# EAGLE design CurrentMonitorOnAStick (EAGLE 7.4.0)
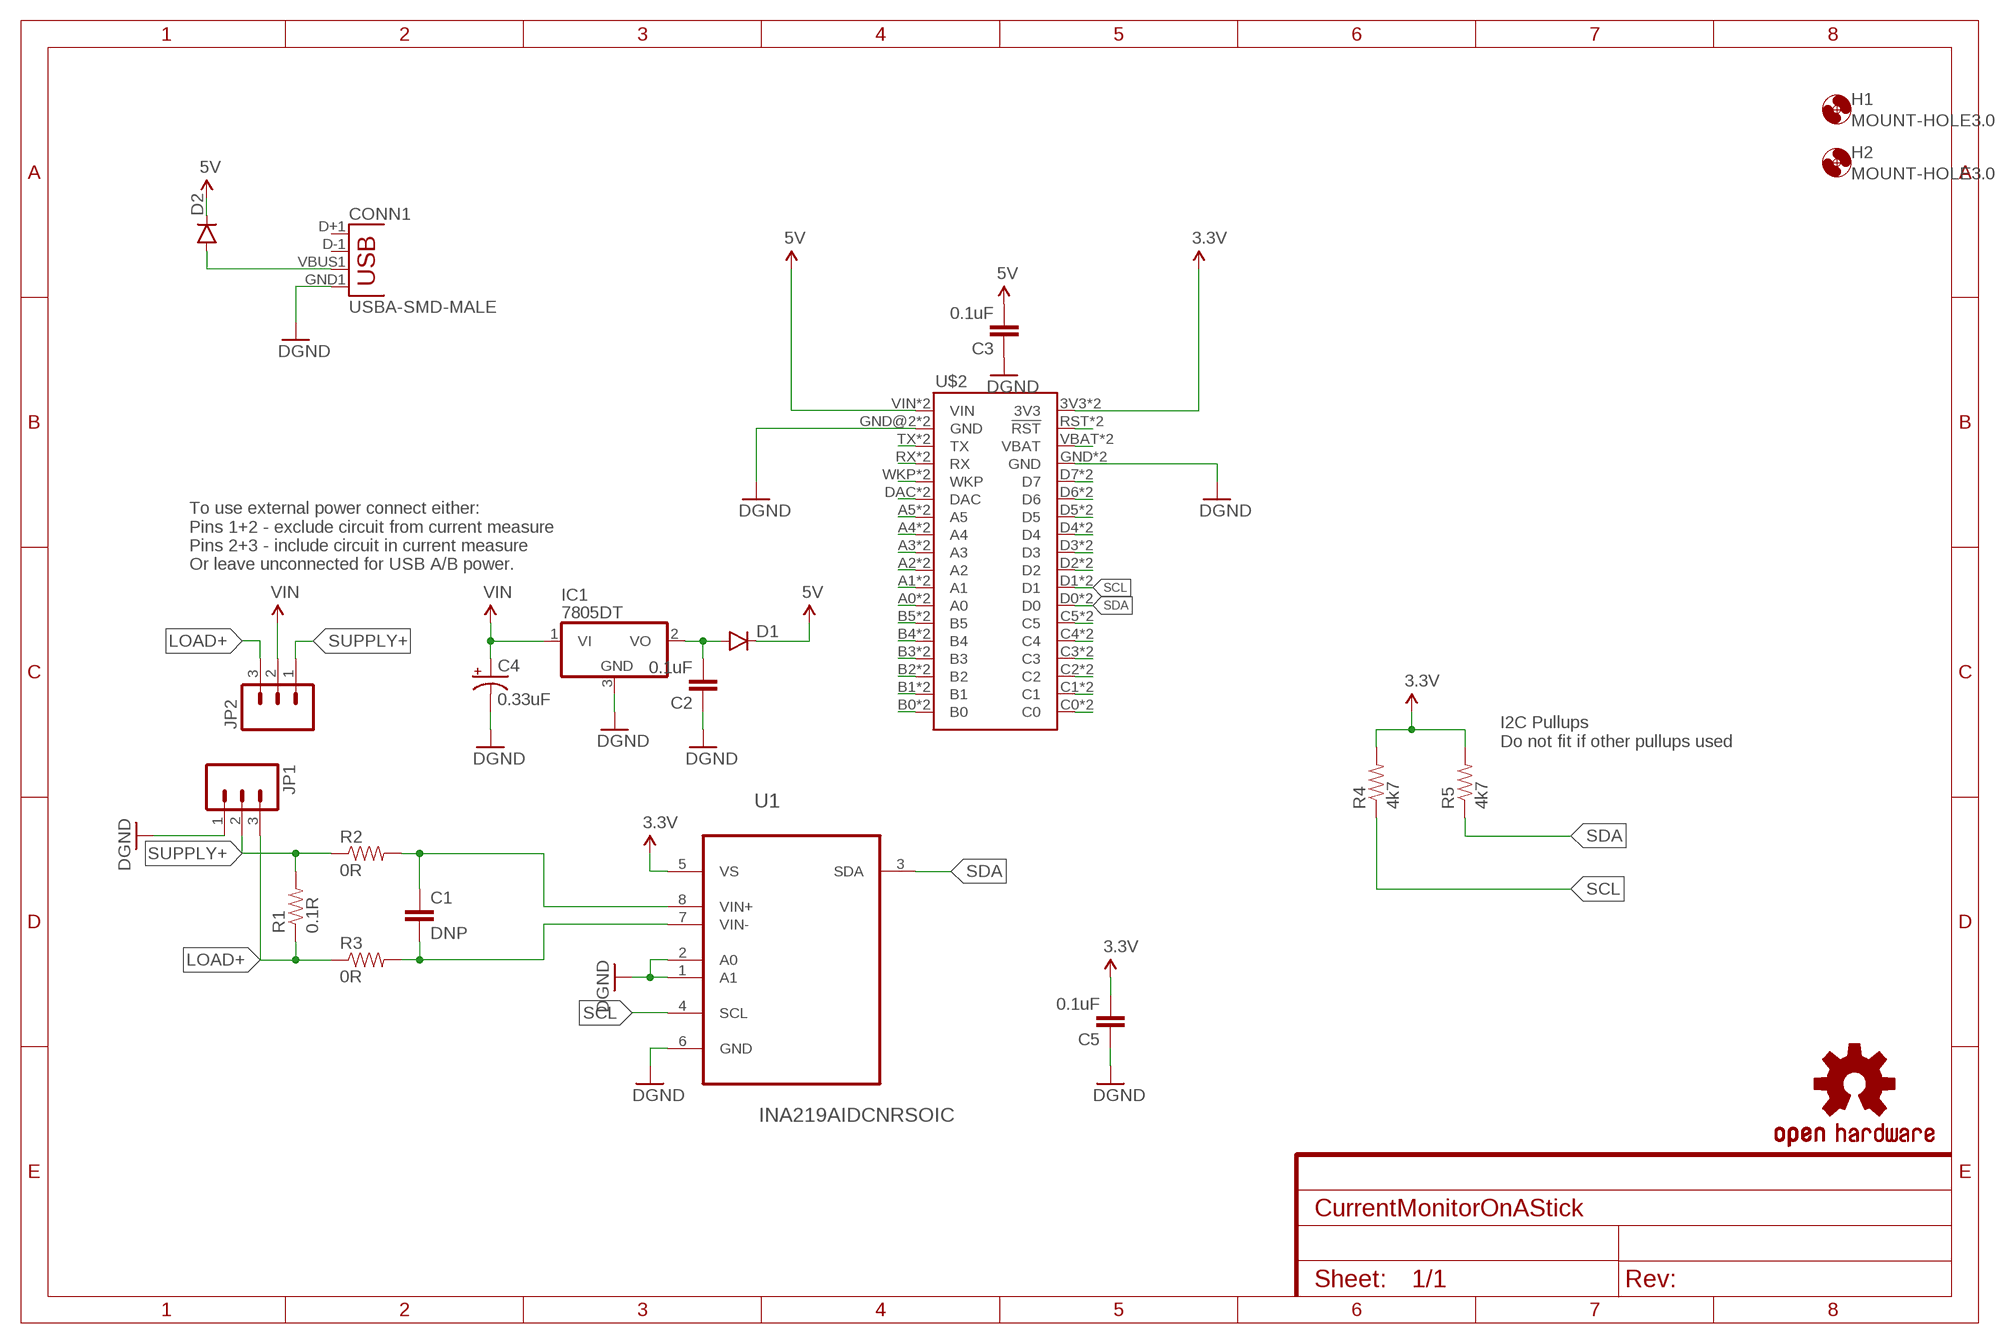
[diagram p0: schematic, sheet 1]

## Parts
C1  DNP  CAP0805  [0805]
C2  0.1uF  CAP0805  [0805]
C3  0.1uF  CAP0805  [0805]
C4  0.33uF  10UF-16V-10%(TANT)  [EIA3216]
C5  0.1uF  CAP0805  [0805]
CONN1  USBA-SMD-MALE  [USB-A-SMT-MALE]
D1  DIODESMA  [SMA-DIODE]
D2  DIODESMA  [SMA-DIODE]
H1  MOUNT-HOLE3.0  [3,0]
H2  MOUNT-HOLE3.0  [3,0]
IC1  7805DT  [TO252]
JP1  M03-SCREW-5MM  [SCREWTERMINAL-5MM-3]
JP2  M03PTH  [1X03]
LOGO2  OSHW-LOGOS  [OSHW-LOGO-S]
R1  0.1R  0.001OHM-3W-1%(2512)3W/1%  [2512]
R2  0R  RESISTOR0805-RES  [0805]
R3  0R  RESISTOR0805-RES  [0805]
R4  4k7  RESISTOR0805-RES  [0805]
R5  4k7  RESISTOR0805-RES  [0805]
U1  INA219AIDCNRSOIC  [SO08]
U$2  ELECTRONDUALNAMED  [ELECTRON_SIMPLE_SILK_NAMES_DUAL]

## Nets
3.3V: C5.2 R4.2 R5.2 U1.5(VS) U$2.3V3 U$2.3V3_1(3V3)
5V: C3.2 D1.C D2.C U$2.VIN U$2.VIN_1B(VIN)
GND: C2.1 C3.1 C4.C(-) C5.1 CONN1.GND1(GND) IC1.3(GND) JP1.1 U1.1(A1) U1.2(A0) U1.6(GND) U$2.GND U$2.GND@2(GND) U$2.GND_1(GND) U$2.GND_1B(GND) ; supply symbol labelled DGND
LOAD+: JP1.3 JP2.3 R1.1 R3.1
N$1: CONN1.VBUS1(VBUS) D2.A
N$3: C2.2 D1.A IC1.2(VO)
N$4: C1.1 R2.2 U1.8(VIN+)
N$6: U$2.VBAT U$2.VBATT_1(VBAT)
N$7: U$2.RST(!RST) U$2.RST_1(!RST)
N$11: U$2.D7 U$2.D7_1(D7)
N$12: C1.2 R3.2 U1.7(VIN-)
N$15: U$2.D6 U$2.D6_1(D6)
N$16: U$2.D5 U$2.D5_1(D5)
N$20: U$2.D4 U$2.D4_1(D4)
N$21: U$2.D3 U$2.D3_1(D3)
N$22: U$2.D2 U$2.D2_1(D2)
N$23: U$2.C5 U$2.C5_1(C5)
N$24: U$2.C4 U$2.C4_1(C4)
N$25: U$2.C3 U$2.C3_1(C3)
N$26: U$2.C2 U$2.C2_1(C2)
N$28: U$2.C1 U$2.C1_1(C1)
N$29: U$2.C0 U$2.C0_1(C0)
N$31: U$2.B0 U$2.B0_1(B0)
N$33: U$2.B1 U$2.B1_1(B1)
N$35: U$2.B2 U$2.B2_1(B2)
N$36: U$2.B3 U$2.B3_1(B3)
N$37: U$2.B4 U$2.B4_1(B4)
N$38: U$2.B5 U$2.B5_1(B5)
N$39: U$2.A0 U$2.A0_1(A0)
N$40: U$2.A1 U$2.A1_1(A1)
N$41: U$2.A2 U$2.A2_1(A2)
N$42: U$2.A3 U$2.A3_1(A3)
N$43: U$2.A4 U$2.A4_1(A4)
N$44: U$2.A5 U$2.A5_1(A5)
N$45: U$2.DAC U$2.DAC_1(DAC)
N$46: U$2.WKP U$2.WKP_1(WKP)
N$47: U$2.RX U$2.RX_1(RX)
N$48: U$2.TX U$2.TX_1(TX)
SCL: R4.1 U1.4(SCL) U$2.D1 U$2.D1_1(D1)
SDA: R5.1 U1.3(SDA) U$2.D0 U$2.D0_1(D0)
SUPPLY+: JP1.2 JP2.1 R1.2 R2.1
VIN: C4.A(+) IC1.1(VI) JP2.2
Unconnected: CONN1.D+1(D+) CONN1.D-1(D-)

## Notes on the sheet
- To use external power connect either:
  Pins 1+2 - exclude circuit from current measure
  Pins 2+3 - include circuit in current measure
  Or leave unconnected for USB A/B power.
- I2C Pullups
  Do not fit if other pullups used

## Library data of the parts
C1 = SparkFun-Capacitors:CAP: Capacitor Standard 0603 ceramic capacitor, and 0.1" leaded capacitor.
C2 C3 C5 = SparkFun-Passives:CAP: Capacitor Standard 0603 ceramic capacitor, and 0.1" leaded capacitor.
C4 = SparkFun-Capacitors:10UF-16V-10%(TANT): CAP-00811 1206/EIA-3216 Tantalum capacitor; PROD_ID: CAP-00811; VALUE: 10uF
CONN1 = SparkFun-Connectors:USB: USB Connectors USB-B-PTH is fully proven SKU : PRT-00139/CONN-08278 USB-miniB is fully proven SKU : PRT-00587 USB-A-PCB is untested. USB-A-H is throughly reviewed, but untested. Spark Fun Electronics SKU : PRT-00437 USB-B-SMT is throughly reviewed, but untested. Needs silkscreen touching up. USB-A-S has not been used/tested USB-MB-H has not been used/tested USB-MICROB has been used. CONN-09505
D1 D2 = SparkFun-DiscreteSemi:DIODE: Diode These are standard reverse protection diodes and small signal diodes. SMA package can handle up to about 1A. SOD-323 can handle about 200mA. What the SOD-323 package when ordering, there are some mfgs out there that are 5-pin packages.
H1 H2 = holes:MOUNT-HOLE: MOUNTING HOLE with drill center marker
IC1 = linear:78*: Positive VOLTAGE REGULATOR Source: http://cache.national.com/ds/LM/LM78L05.pdf http://www.fairchildsemi.com/ds/LM/LM7805.pdf
JP1 = SparkFun-Connectors:M03: Header 3 Standard 3-pin 0.1" header. Use with straight break away headers (SKU : PRT-00116), right angle break away headers (PRT-00553), swiss pins (PRT-00743), machine pins (PRT-00117), and female headers (PRT-00115). Molex polarized connector foot print use with SKU : PRT-08232 with associated crimp pins and housings.; STOREFRONT_ID: PRT-08433
JP2 = SparkFun-Connectors:M03: Header 3 Standard 3-pin 0.1" header. Use with straight break away headers (SKU : PRT-00116), right angle break away headers (PRT-00553), swiss pins (PRT-00743), machine pins (PRT-00117), and female headers (PRT-00115). Molex polarized connector foot print use with SKU : PRT-08232 with associated crimp pins and housings.
LOGO2 = SparkFun-Aesthetics:OSHW-LOGO: Open Source Hardware Logo This logo indicates the piece of hardware it is found on incorporates a OSHW license and/or adheres to the definition of open source hardware found here: http://freedomdefined.org/OSHW
R1 = SparkFun-Resistors:0.001OHM-3W-1%(2512); PROD_ID: RES-12449; VALUE: 0.001
R2-R5 = SparkFun-Resistors:RESISTOR: Resistor Basic schematic elements and footprints for 0603, 1206, and PTH resistors.
U1 = INA219AIDCNR:INA219AIDCNR: CURRENT/POWER MONITOR
U$2 = Tinamous:ELECTRON

## Board
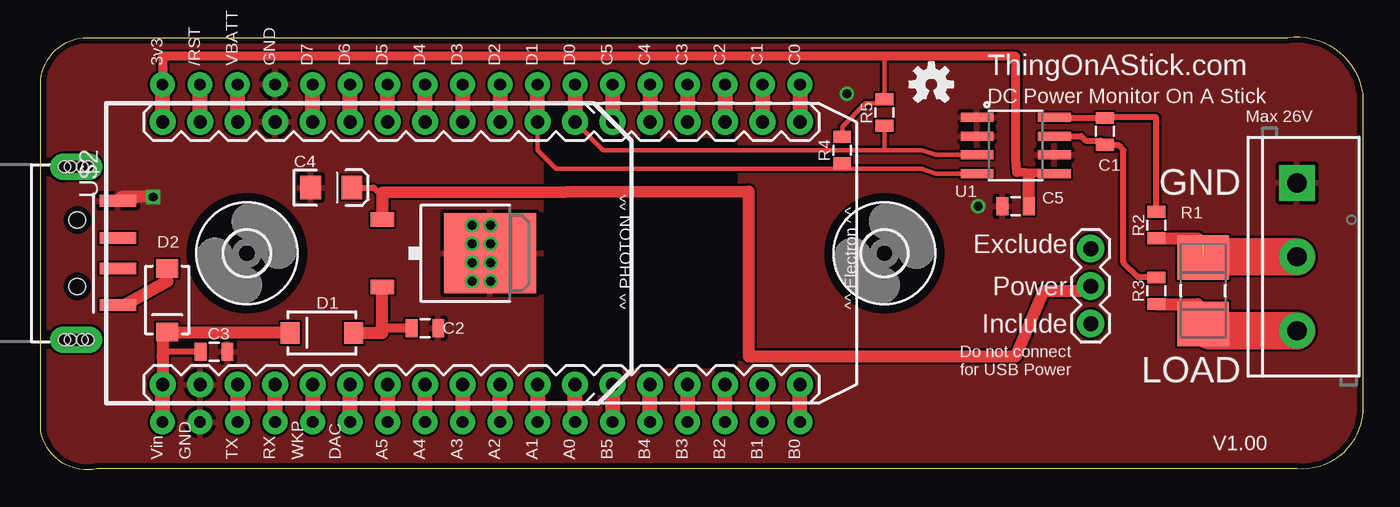
[diagram p1: board, top side]
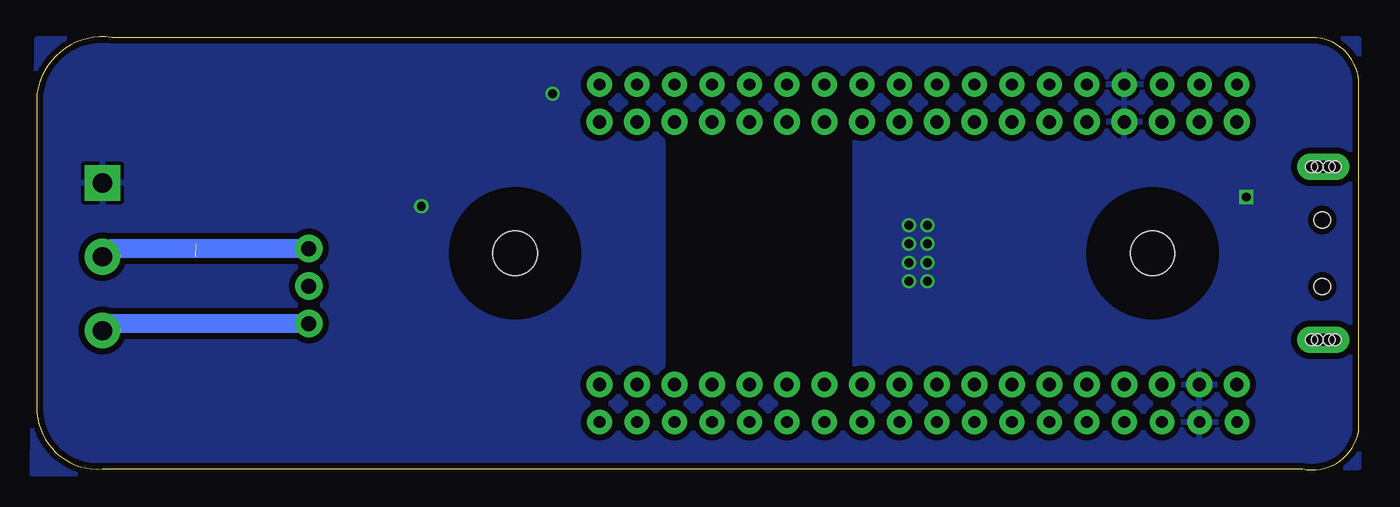
[diagram p2: board, bottom side, seen from below]

Size 89.54 x 29.31 mm. Coordinates in mm from the lower left corner, seen from the top.
Outline: 3.17,29.27 84.45,29.27 arc-90 89.54,25.46 89.54,3.87 arc-90 85.09,0.06 3.81,0.06 arc-90 0,2.6 0,26.1 arc-90 3.17,29.27
Copper layers (1*16): Top 0.0356mm / dielectric 1.5011mm / Bottom 0.0356mm
Design rules "OSHPark": minimum track width 6mil, minimum drill 13mil, track to track 6mil, track to pad 6mil, pad to pad 6mil, via to via 6mil, smd to smd 6mil, copper to edge 15mil, drill to drill 6mil, minimum pad ring 7mil, minimum via ring 7mil, stop-mask expansion 3mil, vias tented up to drill 0mil, thermal gap 10mil
tRestrict: area 34.3,4.5 to 47,24.8
bRestrict: area 34.9,4.5 to 46.4,24.8

### Footprints (pad centres in the part's own frame; a part is rotated, then mirrored left to right if it is on the bottom)
0805 = smd 0.8 x 1.2: 1 -0.9,0; 2 0.9,0
EIA3216 = smd 1.4 x 1.6: A 1.4,0; C -1.4,0
USB-A-SMT-MALE = smd 0.8 x 2.5: D+1 1.027,-5.87; D-1 -1.027,-5.87; GND1 3.551,-5.87; VBUS1 -3.5,-5.87 | drill 0.8 pad 1.778 long: P$1 5.85,-3.05; P$3 -5.85,-3.05 | hole 1.1: 2.25,-3.12; -2.25,-3.12 | hole 0.8: -5.85,-3.45; -5.85,-3.85; -5.85,-2.65; -5.85,-2.25; 5.85,-3.45; 5.85,-3.85; 5.85,-2.65; 5.85,-2.25
SMA-DIODE = smd 1.27 x 1.47: A -2.15,0; C 2.15,0
3,0 = hole 3: 0,0
TO252 = smd 1 x 1.6: 1 -2.28,-4.8; 2 2.28,-4.8 | smd 5.4 x 6.2: 3 0,2.5
SCREWTERMINAL-5MM-3 = drill 1.3 pad 2.413 square: 1 0,0 | drill 1.3 pad 2.413: 2 5,0; 3 10,0
1X03 = drill 1.016 pad 1.88: 1 0,0; 2 2.54,0; 3 5.08,0
2512 = smd 3 x 3.5: 1 -2.25,0; 2 2.25,0
SO08 = smd 0.61 x 2.21: 1 -1.905,-2.616; 2 -0.635,-2.616; 3 0.635,-2.616; 4 1.905,-2.616; 5 1.905,2.616; 6 0.635,2.616; 7 -0.635,2.616; 8 -1.905,2.616
ELECTRON_SIMPLE_SILK_NAMES_DUAL = drill 0.889 pad 1.753: 3V3 1.27,22.86; A0 29.21,5.08; A1 26.67,5.08; A2 24.13,5.08; A3 21.59,5.08; A4 19.05,5.08; A5 16.51,5.08; B0 44.45,5.08; B1 41.91,5.08; B2 39.37,5.08; B3 36.83,5.08; B4 34.29,5.08; B5 31.75,5.08; C0 44.45,22.86; C1 41.91,22.86; C2 39.37,22.86; C3 36.83,22.86; C4 34.29,22.86; C5 31.75,22.86; D0 29.21,22.86; D1 26.67,22.86; D2 24.13,22.86; D3 21.59,22.86; D4 19.05,22.86; D5 16.51,22.86; D6 13.97,22.86; D7 11.43,22.86; DAC 13.97,5.08; GND 8.89,22.86; GND@2 3.81,5.08; RST 3.81,22.86; RX 8.89,5.08; TX 6.35,5.08; VBAT 6.35,22.86; VIN 1.27,5.08; WKP 11.43,5.08 | drill 0.8 pad 1.676: 3V3_1 1.27,25.4; A0_1 29.21,2.54; A1_1 26.67,2.54; A2_1 24.13,2.54; A3_1 21.59,2.54; A4_1 19.05,2.54; A5_1 16.51,2.54; B0_1 44.45,2.54; B1_1 41.91,2.54; B2_1 39.37,2.54; B3_1 36.83,2.54; B4_1 34.29,2.54; B5_1 31.75,2.54; C0_1 44.45,25.4; C1_1 41.91,25.4; C2_1 39.37,25.4; C3_1 36.83,25.4; C4_1 34.29,25.4; C5_1 31.75,25.4; D0_1 29.21,25.4; D1_1 26.67,25.4; D2_1 24.13,25.4; D3_1 21.59,25.4; D4_1 19.05,25.4; D5_1 16.51,25.4; D6_1 13.97,25.4; D7_1 11.43,25.4; DAC_1 13.97,2.54; GND_1 8.89,25.4; GND_1B 3.81,2.54; RST_1 3.81,25.4; RX_1 8.89,2.54; TX_1 6.35,2.54; VBATT_1 6.35,25.4; VIN_1B 1.27,2.54; WKP_1 11.43,2.54

### Placement (x,y rotation side)
C1  72.07,22.92 270 top
C2  26.03,9.59 180 top
C3  11.75,8 180 top
C4  19.68,19.11 0 top
C5  66.04,17.84 0 top
CONN1  -0.63,14.67 90 top
D1  19.05,9.27 180 top
D2  8.57,11.49 270 top
H1  13.97,14.67 0 top
H2  57.15,14.67 0 top
IC1  27.94,14.67 270 top
JP1  85.09,19.43 270 top
JP2  71.12,14.99 270 top
LOGO2  60.32,26.1 0 top
R1  78.74,12.13 90 top
R2  75.57,16.57 90 top
R3  75.57,12.13 90 top
R4  54.29,21.65 90 top
R5  57.15,24.19 90 top
U1  66.04,21.97 270 top
U$2  6.99,0.7 0 top

### Tracks (layer width: path | path; a pad name or v marks a point on that pad's centre or on a via)
3.3V
  Top 0.305: 66.94,19.87 66.69,20.12 | 57.15,28 R5.2 56.88,24.83 55.88,24.83 54.29,23.24 R4.2
  Top 0.61: U1.5 66.69,20.12 66.12,20.14 66.04,21.02 66.04,28 57.15,28 8.26,28 U$2.3V3
  Top 0.813: C5.2 66.94,19.87
  Top 1.016: U$2.3V3 U$2.3V3_1
5V
  Top 0.406: 17.14,9.59 17.22,9.59 D1.C | C3.2 8.57,8 8.26,7.68
  Top 0.813: D1.C 8.26,9.27 | 8.26,9.27 8.26,7.68 U$2.VIN | D2.C 8.26,9.34 8.26,9.27
  Top 1.016: U$2.VIN_1B U$2.VIN
GND  (via drill 0.6)
  Top 0.813: v7.62,18.48 5.49,18.48 CONN1.GND1
  other vias: 29.21,16.57 30.48,16.57 29.21,15.3 30.48,15.3 29.21,14.03 30.48,14.03 29.21,12.76 30.48,12.76 63.5,17.84 54.61,25.46
  pour Bottom (isolate 0.406): 0,29.15 89.54,29.15 89.85,-0.25 40,0.06 36.58,-0.13 0,0.19
  pour Top: 0,29.27 89.54,29.27 89.85,-0.25 0,0.06
LOAD+
  Top 0.813: R3.1 78.37,11.23 78.74,10.86 R1.1
  Top 2.54: JP1.3 79.19,9.43 R1.1
  Bottom 1.27: JP2.3 84.62,9.91 JP1.3
N$1
  Top 0.813: CONN1.VBUS1 5.71,11.17 8.57,12.76 D2.A
N$3
  Top 0.61: C2.2 23.14,9.59
  Top 0.813: D1.A 23.14,9.27 23.14,9.59 IC1.2
N$4
  Top 0.406: R2.2 75.57,23.87 72.12,23.87 C1.1 68.71,23.82 U1.8
N$6
  Top 1.016: U$2.VBAT U$2.VBATT_1
N$7
  Top 1.016: U$2.RST U$2.RST_1
N$11
  Top 1.016: U$2.D7 U$2.D7_1
N$12
  Top 0.406: U1.7 70.48,22.6 70.8,22.29 71.81,22.29 C1.2 72.12,21.97 73.03,21.97 73.34,21.65 73.34,14.03 74.35,13.03 R3.2
N$15
  Top 1.016: U$2.D6 U$2.D6_1
N$16
  Top 1.016: U$2.D5 U$2.D5_1
N$20
  Top 1.016: U$2.D4 U$2.D4_1
N$21
  Top 1.016: U$2.D3_1 U$2.D3
N$22
  Top 1.016: U$2.D2_1 U$2.D2
N$23
  Top 1.016: U$2.C5_1 U$2.C5
N$24
  Top 1.016: U$2.C4_1 U$2.C4
N$25
  Top 1.016: U$2.C3_1 U$2.C3
N$26
  Top 1.016: U$2.C2_1 U$2.C2
N$28
  Top 1.016: U$2.C1_1 U$2.C1
N$29
  Top 1.016: U$2.C0_1 U$2.C0
N$31
  Top 1.016: U$2.B0_1 U$2.B0
N$33
  Top 1.016: U$2.B1 U$2.B1_1
N$35
  Top 1.016: U$2.B2_1 U$2.B2
N$36
  Top 1.016: U$2.B3 U$2.B3_1
N$37
  Top 1.016: U$2.B4_1 U$2.B4
N$38
  Top 1.016: U$2.B5 U$2.B5_1
N$39
  Top 1.016: U$2.A0_1 U$2.A0
N$40
  Top 1.016: U$2.A1 U$2.A1_1
N$41
  Top 1.016: U$2.A2_1 U$2.A2
N$42
  Top 1.016: U$2.A3 U$2.A3_1
N$43
  Top 1.016: U$2.A4_1 U$2.A4
N$44
  Top 1.016: U$2.A5 U$2.A5_1
N$45
  Top 1.016: U$2.DAC_1 U$2.DAC
N$46
  Top 1.016: U$2.WKP U$2.WKP_1
N$47
  Top 1.016: U$2.RX_1 U$2.RX
N$48
  Top 1.016: U$2.TX U$2.TX_1
SCL
  Top 0.305: U1.4 60.64,20.07 59.69,20.38 54.61,20.38 | 54.61,20.38 34.92,20.38 33.66,21.65 U$2.D1 | R4.1 54.29,20.7 54.61,20.38
  Top 1.016: U$2.D1 U$2.D1_1
SDA
  Top 0.305: U1.3 60.64,21.33 59.69,21.65 57.15,21.65 | 57.15,21.65 38.1,21.65 U$2.D0 | R5.1 57.15,21.65
  Top 1.016: U$2.D0_1 U$2.D0
SUPPLY+  (1 unrouted)
  Top 0.813: R2.1 78.37,15.67 78.74,15.3
  Top 2.54: JP1.2 78.79,14.43 R1.2
  Bottom 1.27: JP2.1 84.54,14.99 JP1.2
VIN
  Top 0.406: C4.A 22.54,19.11 23.18,18.48
  Top 0.813: IC1.1 23.18,16.95 23.18,18.48 23.18,18.8 47.94,18.85 47.94,7.68 66.04,7.68 67.95,12.13 70.8,12.13 JP2.2

### Text on the board
tNames: ThingOnAStick.com | DC Power Monitor On A Stick | Max 26V | GND | Exclude | Power | ^^ PHOTON ^^ | ^^ Electron ^^ | Include | LOAD | Do not connect / for USB Power | V1.00